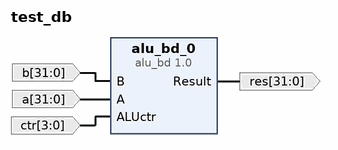
[diagram p0: block diagram of the top level]
# Vivado block design test_db, Vivado 2016.2
create_bd_design test_db

create_bd_port -dir I -from 31 -to 0 a
create_bd_port -dir I -from 31 -to 0 b
create_bd_port -dir O -from 31 -to 0 res
create_bd_port -dir I -from 3 -to 0 ctr

create_bd_cell -type ip -vlnv CSE:CSE:alu_bd:1.0 alu_bd_0

# ---- connections ----

connect_bd_net [get_bd_ports b] [get_bd_pins alu_bd_0/B]
connect_bd_net [get_bd_ports a] [get_bd_pins alu_bd_0/A]
connect_bd_net [get_bd_pins alu_bd_0/Result] [get_bd_ports res]
connect_bd_net [get_bd_ports ctr] [get_bd_pins alu_bd_0/ALUctr]

validate_bd_design
save_bd_design
